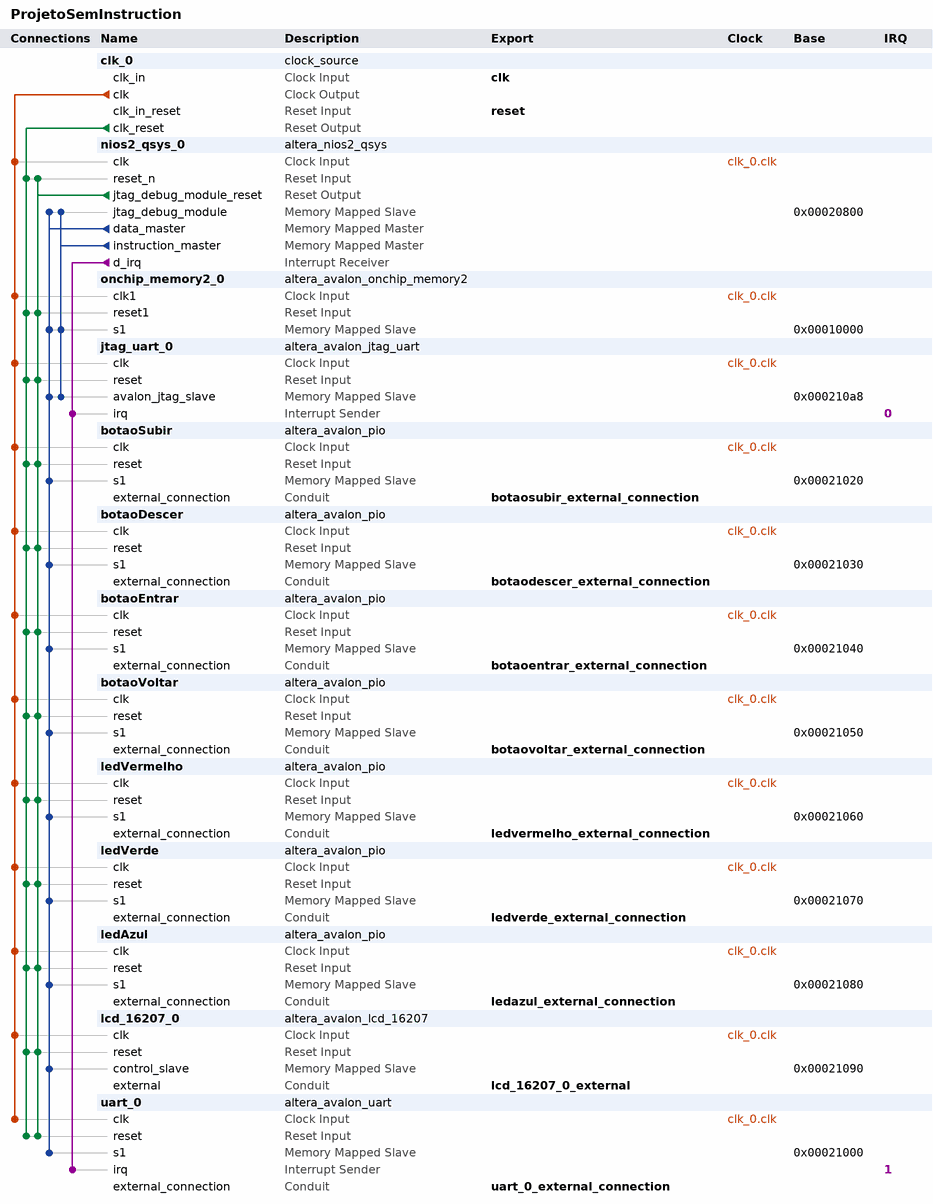
[diagram p0: system contents]
# Platform Designer (Qsys) system ProjetoSemInstruction, Cyclone IV E EP4CE30F23C7
# Parameters at their usual value, and those the tool derives, are not listed.
package require -exact qsys 18.1
create_system ProjetoSemInstruction
set_project_property DEVICE_FAMILY {Cyclone IV E}
set_project_property DEVICE EP4CE30F23C7

add_instance clk_0 clock_source 18.1
set_instance_parameter_value clk_0 clockFrequency 50000000

add_instance nios2_qsys_0 altera_nios2_qsys 16.1
set_instance_parameter_value nios2_qsys_0 breakSlave nios2_qsys_0.jtag_debug_module
set_instance_parameter_value nios2_qsys_0 exceptionSlave onchip_memory2_0.s1
set_instance_parameter_value nios2_qsys_0 icache_size 4096
set_instance_parameter_value nios2_qsys_0 impl Tiny
set_instance_parameter_value nios2_qsys_0 mmu_TLBMissExcSlave None
set_instance_parameter_value nios2_qsys_0 resetSlave onchip_memory2_0.s1
set_instance_parameter_value nios2_qsys_0 resetrequest_enabled true

add_instance onchip_memory2_0 altera_avalon_onchip_memory2 18.1
set_instance_parameter_value onchip_memory2_0 dataWidth 32
set_instance_parameter_value onchip_memory2_0 dualPort false
set_instance_parameter_value onchip_memory2_0 initMemContent true
set_instance_parameter_value onchip_memory2_0 initializationFileName onchip_mem.hex
set_instance_parameter_value onchip_memory2_0 memorySize 40096

add_instance jtag_uart_0 altera_avalon_jtag_uart 18.1
set_instance_parameter_value jtag_uart_0 simInteractiveOptions NO_INTERACTIVE_WINDOWS

add_instance botaoSubir altera_avalon_pio 18.1
set_instance_parameter_value botaoSubir direction Input
set_instance_parameter_value botaoSubir width 1

add_instance botaoDescer altera_avalon_pio 18.1
set_instance_parameter_value botaoDescer direction Input
set_instance_parameter_value botaoDescer width 1

add_instance botaoEntrar altera_avalon_pio 18.1
set_instance_parameter_value botaoEntrar direction Input
set_instance_parameter_value botaoEntrar width 1

add_instance botaoVoltar altera_avalon_pio 18.1
set_instance_parameter_value botaoVoltar direction Input
set_instance_parameter_value botaoVoltar width 1

add_instance ledVermelho altera_avalon_pio 18.1
set_instance_parameter_value ledVermelho direction Output
set_instance_parameter_value ledVermelho width 1

add_instance ledVerde altera_avalon_pio 18.1
set_instance_parameter_value ledVerde direction Output
set_instance_parameter_value ledVerde width 1

add_instance ledAzul altera_avalon_pio 18.1
set_instance_parameter_value ledAzul direction Output
set_instance_parameter_value ledAzul width 1

add_instance lcd_16207_0 altera_avalon_lcd_16207 18.1

add_instance uart_0 altera_avalon_uart 18.1
set_instance_parameter_value uart_0 baud 115200
set_instance_parameter_value uart_0 dataBits 8
set_instance_parameter_value uart_0 fixedBaud true
set_instance_parameter_value uart_0 parity NONE
set_instance_parameter_value uart_0 stopBits 1

# connections
add_connection clk_0.clk botaoDescer.clk clock
add_connection clk_0.clk botaoEntrar.clk clock
add_connection clk_0.clk botaoSubir.clk clock
add_connection clk_0.clk botaoVoltar.clk clock
add_connection clk_0.clk jtag_uart_0.clk clock
add_connection clk_0.clk lcd_16207_0.clk clock
add_connection clk_0.clk ledAzul.clk clock
add_connection clk_0.clk ledVerde.clk clock
add_connection clk_0.clk ledVermelho.clk clock
add_connection clk_0.clk nios2_qsys_0.clk clock
add_connection clk_0.clk onchip_memory2_0.clk1 clock
add_connection clk_0.clk uart_0.clk clock
add_connection clk_0.clk_reset botaoDescer.reset reset
add_connection clk_0.clk_reset botaoEntrar.reset reset
add_connection clk_0.clk_reset botaoSubir.reset reset
add_connection clk_0.clk_reset botaoVoltar.reset reset
add_connection clk_0.clk_reset jtag_uart_0.reset reset
add_connection clk_0.clk_reset lcd_16207_0.reset reset
add_connection clk_0.clk_reset ledAzul.reset reset
add_connection clk_0.clk_reset ledVerde.reset reset
add_connection clk_0.clk_reset ledVermelho.reset reset
add_connection clk_0.clk_reset nios2_qsys_0.reset_n reset
add_connection clk_0.clk_reset onchip_memory2_0.reset1 reset
add_connection clk_0.clk_reset uart_0.reset reset
add_connection nios2_qsys_0.jtag_debug_module_reset botaoDescer.reset reset
add_connection nios2_qsys_0.jtag_debug_module_reset botaoEntrar.reset reset
add_connection nios2_qsys_0.jtag_debug_module_reset botaoSubir.reset reset
add_connection nios2_qsys_0.jtag_debug_module_reset botaoVoltar.reset reset
add_connection nios2_qsys_0.jtag_debug_module_reset jtag_uart_0.reset reset
add_connection nios2_qsys_0.jtag_debug_module_reset lcd_16207_0.reset reset
add_connection nios2_qsys_0.jtag_debug_module_reset ledAzul.reset reset
add_connection nios2_qsys_0.jtag_debug_module_reset ledVerde.reset reset
add_connection nios2_qsys_0.jtag_debug_module_reset ledVermelho.reset reset
add_connection nios2_qsys_0.jtag_debug_module_reset nios2_qsys_0.reset_n reset
add_connection nios2_qsys_0.jtag_debug_module_reset onchip_memory2_0.reset1 reset
add_connection nios2_qsys_0.jtag_debug_module_reset uart_0.reset reset
add_connection nios2_qsys_0.data_master botaoDescer.s1 avalon
set_connection_parameter_value nios2_qsys_0.data_master/botaoDescer.s1 baseAddress 0x00021030
add_connection nios2_qsys_0.data_master botaoEntrar.s1 avalon
set_connection_parameter_value nios2_qsys_0.data_master/botaoEntrar.s1 baseAddress 0x00021040
add_connection nios2_qsys_0.data_master botaoSubir.s1 avalon
set_connection_parameter_value nios2_qsys_0.data_master/botaoSubir.s1 baseAddress 0x00021020
add_connection nios2_qsys_0.data_master botaoVoltar.s1 avalon
set_connection_parameter_value nios2_qsys_0.data_master/botaoVoltar.s1 baseAddress 0x00021050
add_connection nios2_qsys_0.data_master jtag_uart_0.avalon_jtag_slave avalon
set_connection_parameter_value nios2_qsys_0.data_master/jtag_uart_0.avalon_jtag_slave baseAddress 0x000210a8
add_connection nios2_qsys_0.data_master lcd_16207_0.control_slave avalon
set_connection_parameter_value nios2_qsys_0.data_master/lcd_16207_0.control_slave baseAddress 0x00021090
add_connection nios2_qsys_0.data_master ledAzul.s1 avalon
set_connection_parameter_value nios2_qsys_0.data_master/ledAzul.s1 baseAddress 0x00021080
add_connection nios2_qsys_0.data_master ledVerde.s1 avalon
set_connection_parameter_value nios2_qsys_0.data_master/ledVerde.s1 baseAddress 0x00021070
add_connection nios2_qsys_0.data_master ledVermelho.s1 avalon
set_connection_parameter_value nios2_qsys_0.data_master/ledVermelho.s1 baseAddress 0x00021060
add_connection nios2_qsys_0.data_master nios2_qsys_0.jtag_debug_module avalon
set_connection_parameter_value nios2_qsys_0.data_master/nios2_qsys_0.jtag_debug_module baseAddress 0x00020800
add_connection nios2_qsys_0.data_master onchip_memory2_0.s1 avalon
set_connection_parameter_value nios2_qsys_0.data_master/onchip_memory2_0.s1 baseAddress 0x00010000
add_connection nios2_qsys_0.data_master uart_0.s1 avalon
set_connection_parameter_value nios2_qsys_0.data_master/uart_0.s1 baseAddress 0x00021000
add_connection nios2_qsys_0.instruction_master jtag_uart_0.avalon_jtag_slave avalon
set_connection_parameter_value nios2_qsys_0.instruction_master/jtag_uart_0.avalon_jtag_slave baseAddress 0x000210a8
add_connection nios2_qsys_0.instruction_master nios2_qsys_0.jtag_debug_module avalon
set_connection_parameter_value nios2_qsys_0.instruction_master/nios2_qsys_0.jtag_debug_module baseAddress 0x00020800
add_connection nios2_qsys_0.instruction_master onchip_memory2_0.s1 avalon
set_connection_parameter_value nios2_qsys_0.instruction_master/onchip_memory2_0.s1 baseAddress 0x00010000
add_connection nios2_qsys_0.d_irq jtag_uart_0.irq interrupt
set_connection_parameter_value nios2_qsys_0.d_irq/jtag_uart_0.irq irqNumber 0
add_connection nios2_qsys_0.d_irq uart_0.irq interrupt
set_connection_parameter_value nios2_qsys_0.d_irq/uart_0.irq irqNumber 1

# exported interfaces
add_interface botaodescer_external_connection conduit end
set_interface_property botaodescer_external_connection EXPORT_OF botaoDescer.external_connection
add_interface botaoentrar_external_connection conduit end
set_interface_property botaoentrar_external_connection EXPORT_OF botaoEntrar.external_connection
add_interface botaosubir_external_connection conduit end
set_interface_property botaosubir_external_connection EXPORT_OF botaoSubir.external_connection
add_interface botaovoltar_external_connection conduit end
set_interface_property botaovoltar_external_connection EXPORT_OF botaoVoltar.external_connection
add_interface clk clock sink
set_interface_property clk EXPORT_OF clk_0.clk_in
add_interface lcd_16207_0_external conduit end
set_interface_property lcd_16207_0_external EXPORT_OF lcd_16207_0.external
add_interface ledazul_external_connection conduit end
set_interface_property ledazul_external_connection EXPORT_OF ledAzul.external_connection
add_interface ledverde_external_connection conduit end
set_interface_property ledverde_external_connection EXPORT_OF ledVerde.external_connection
add_interface ledvermelho_external_connection conduit end
set_interface_property ledvermelho_external_connection EXPORT_OF ledVermelho.external_connection
add_interface reset reset sink
set_interface_property reset EXPORT_OF clk_0.clk_in_reset
add_interface uart_0_external_connection conduit end
set_interface_property uart_0_external_connection EXPORT_OF uart_0.external_connection

set_interconnect_requirement {$system} qsys_mm.clockCrossingAdapter HANDSHAKE
set_interconnect_requirement {$system} qsys_mm.enableEccProtection FALSE
set_interconnect_requirement {$system} qsys_mm.insertDefaultSlave FALSE
set_interconnect_requirement {$system} qsys_mm.maxAdditionalLatency 1

save_system ProjetoSemInstruction.qsys
